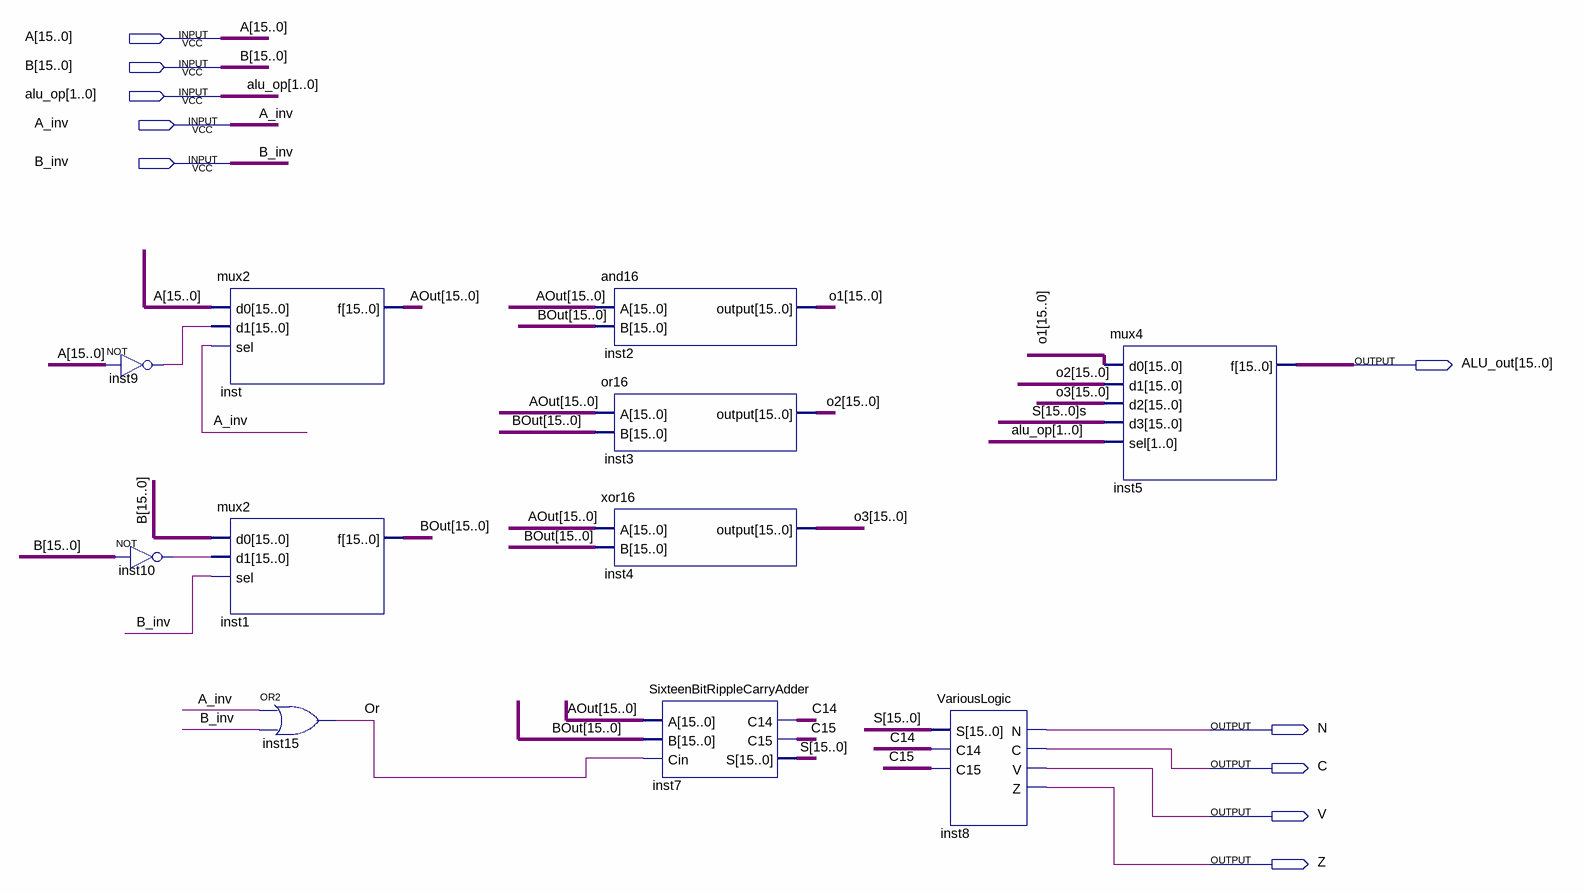
[diagram p0: schematic sheet]
// Quartus schematic ALU.bdf as structural Verilog: 11 symbols, 10 pins
module ALU (
  input  [15:0] A,
  input  [15:0] B,
  input  [1:0] alu_op,
  input  A_inv,
  input  B_inv,
  output [15:0] ALU_out,
  output N,
  output C,
  output V,
  output Z
);

  wire C14, C15, inst9_out, inst10_out, Or, \S[15..0]s ;
  wire [15:0] AOut, BOut, o1, o2, o3, S;

  assign inst9_out = ~A;  // NOT inst9, 16 bits wide
  assign inst10_out = ~B;  // NOT inst10, 16 bits wide
  mux2 inst (.d0(A), .d1({16{inst9_out}}), .sel(A_inv), .f(AOut));
  mux2 inst1 (.d0(B), .d1({16{inst10_out}}), .sel(B_inv), .f(BOut));
  or inst15 (Or, A_inv, B_inv);
  and16 inst2 (.A(AOut), .B(BOut), .\output (o1));
  or16 inst3 (.A(AOut), .B(BOut), .\output (o2));
  xor16 inst4 (.A(AOut), .B(BOut), .\output (o3));
  SixteenBitRippleCarryAdder inst7 (.A(AOut), .B(BOut), .Cin(Or), .C14(C14), .C15(C15), .S(S));
  VariousLogic inst8 (.S(S), .C14(C14), .C15(C15), .N(N), .C(C), .V(V), .Z(Z));
  mux4 inst5 (.d0(o1), .d1(o2), .d2(o3), .d3({16{\S[15..0]s }}), .sel(alu_op), .f(ALU_out));
endmodule
